# EAGLE design receiver_mp3 (EAGLE 9.4.2)
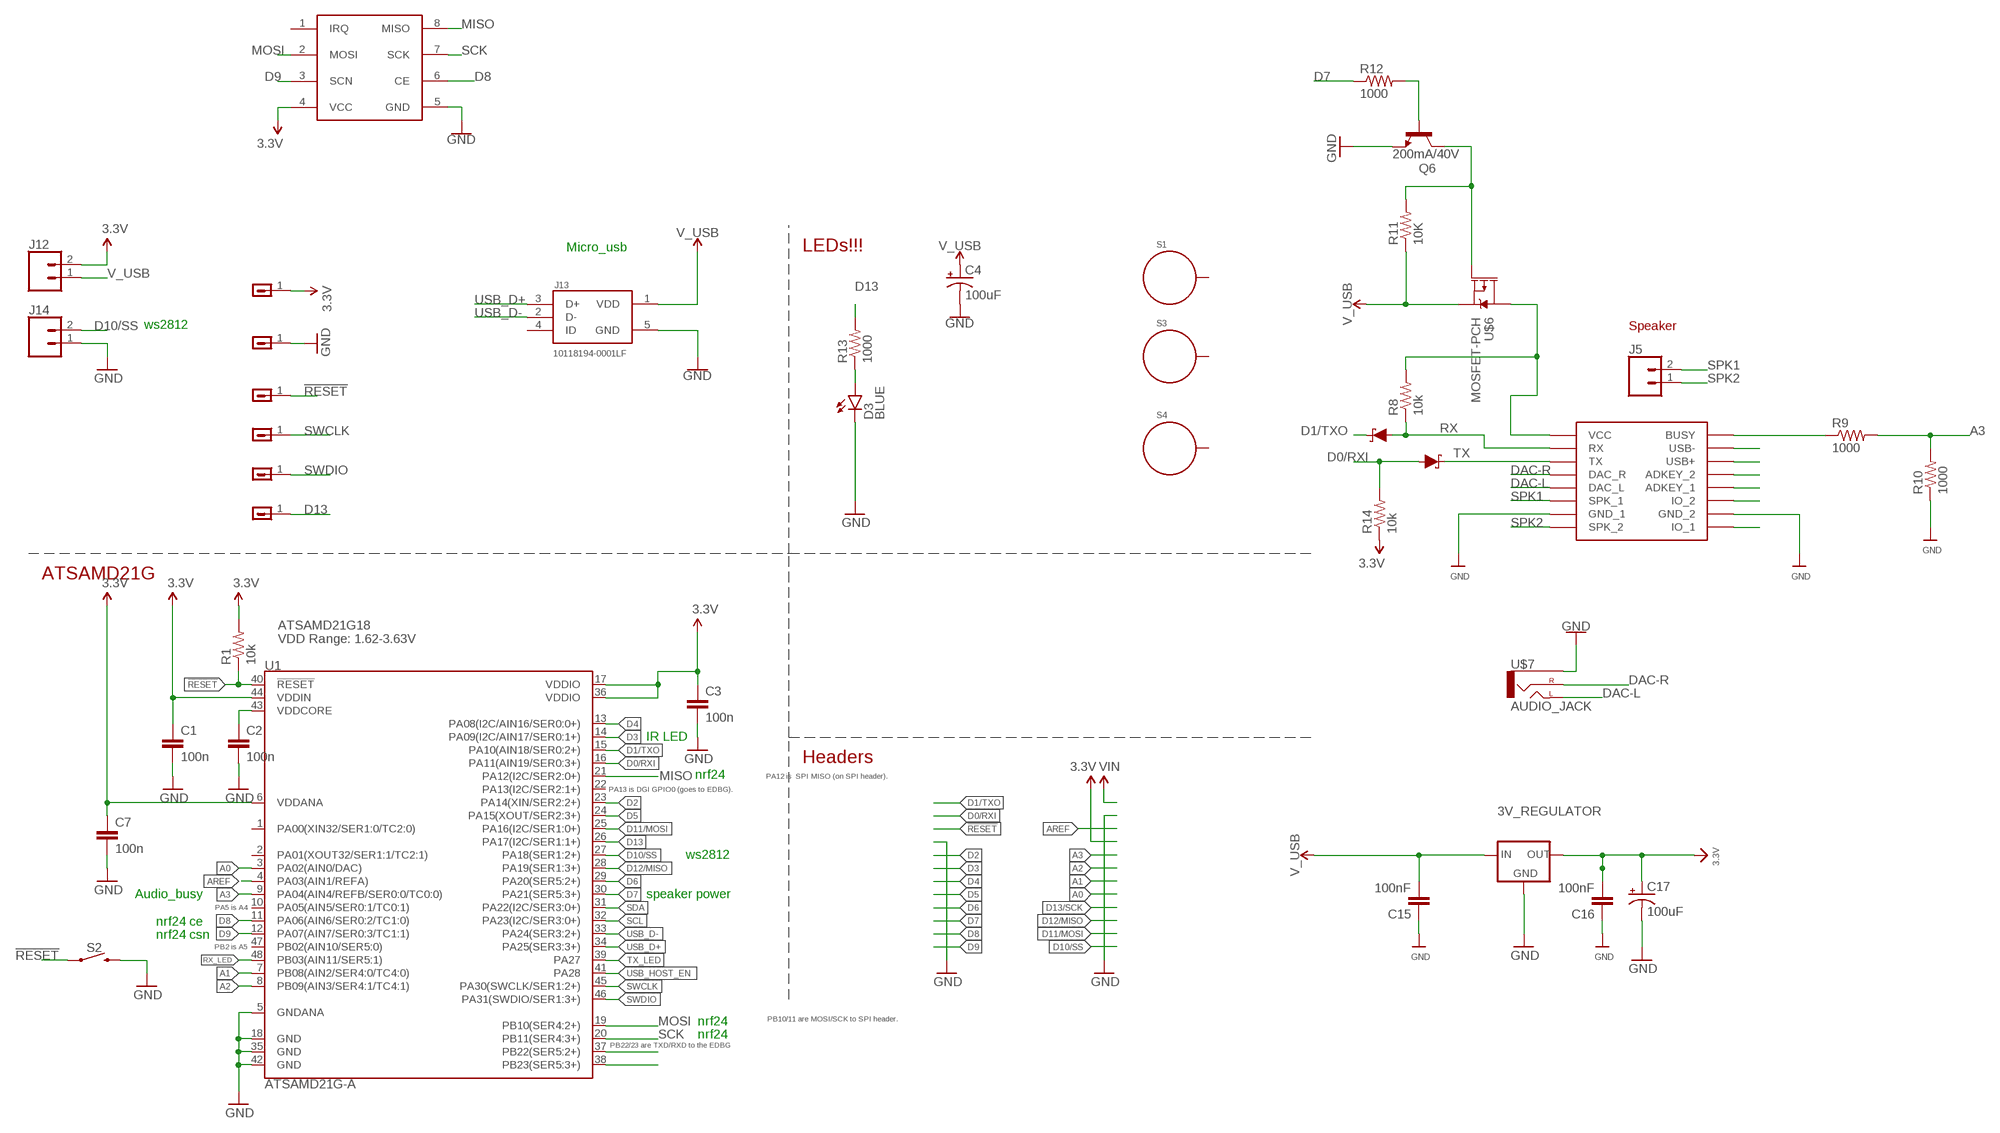
[diagram p0: schematic, sheet 1]

## Parts
3V_REGULATOR  LDL1117_5V_REG  [SOT223]
C1  100n  CAP0805  [0805]
C2  100n  CAP0805  [0805]
C3  100n  CAP0805  [0805]
C4  100uF  100UF-POLAR-RADIAL-2.5MM-25V-20%  [CPOL-RADIAL-2.5MM-6.5MM]
C7  100n  CAP0805  [0805]
C15  100nF  10UF-0805-10V-10%  [0805]
C16  100nF  10UF-0805-10V-10%  [0805]
C17  100uF  100UF-POLAR-RADIAL-2.5MM-25V-20%  [CPOL-RADIAL-2.5MM-6.5MM]
D1  3A/40V/500mV  DIODE-SCHOTTKY-B340A  [SMA-DIODE]
D3  BLUE  LED-BLUE1206  [LED-1206]
D5  3A/40V/500mV  DIODE-SCHOTTKY-B340A  [SMA-DIODE]
J5  CONN_025MM  [SCREWTERMINAL-5MM-2]
J12  CONN_025MM  [SCREWTERMINAL-5MM-2]
J13  10118194-0001LF  [FRAMATOME_10118194-0001LF]
J14  CONN_025MM  [SCREWTERMINAL-5MM-2]
Q6  200mA/40V  TRANS_NPN-2N3904-EZ  [TO-92-EZ]
R1  10k  RESISTOR0805-RES  [0805]
R8  10k  RESISTOR0805-RES  [0805]
R9  1000  RESISTOR0805-RES  [0805]
R10  1000  RESISTOR0805-RES  [0805]
R11  10K  RESISTOR0805-RES  [0805]
R12  1000  RESISTOR0805-RES  [0805]
R13  1000  RESISTOR0805-RES  [0805]
R14  10k  RESISTOR0805-RES  [0805]
S1  STANDOFF_ELECTRICAL144  [STANDOFF_ELECTRICAL_144MILL_NORMAL_SCREW]
S2  MOMENTARY-SWITCH-SPST-PTH-6.0MM-KIT  [TACTILE_SWITCH_PTH_6.0MM_KIT]
S3  STANDOFF_ELECTRICAL144  [STANDOFF_ELECTRICAL_144MILL_NORMAL_SCREW]
S4  STANDOFF_ELECTRICAL144  [STANDOFF_ELECTRICAL_144MILL_NORMAL_SCREW]
U1  ATSAMD21G-A  [TQFP-48]
U$1  DFPLAYER  [DFPLAYER]
U$3  NRF24L01  [NRF24L01]
U$6  MOSFET-PCH  [DPAK]
U$7  AUDIO_JACK  [1/8"AUDIO_JACK]
U$8  CONN_011.27MM  [1X01-1.27MM]
U$13  CONN_011.27MM  [1X01-1.27MM]
U$18  CONN_011.27MM  [1X01-1.27MM]
U$19  CONN_011.27MM  [1X01-1.27MM]
U$20  CONN_011.27MM  [1X01-1.27MM]
U$22  CONN_011.27MM  [1X01-1.27MM]

## Nets
3.3V: 3V_REGULATOR.2(OUT) 3V_REGULATOR.4(OUT) C1.1 C3.1 C7.1 C16.2 C17.1(+) J12.2 R1.2 R14.1 U1.6(VDDANA) U1.17(VDDIO) U1.36(VDDIO) U1.44(VDDIN) U$3.4(VCC) U$18.1
!RESET: R1.1 S2.1 U1.40(!RESET!) U$20.1
A0: U1.3(PA02(AIN0/DAC))
A1: U1.7(PB08(AIN2/SER4:0/TC4:0))
A2: U1.8(PB09(AIN3/SER4:1/TC4:1))
A3: R9.2 R10.2 U1.9(PA04(AIN4/REFB/SER0:0/TC0:0))
AREF: U1.4(PA03(AIN1/REFA))
D0/RXI: D5.A R14.2 U1.16(PA11(AIN19/SER0:3+))
D1/TXO: D1.C U1.15(PA10(AIN18/SER0:2+))
D2: U1.23(PA14(XIN/SER2:2+))
D3: U1.14(PA09(I2C/AIN17/SER0:1+))
D4: U1.13(PA08(I2C/AIN16/SER0:0+))
D5: U1.24(PA15(XOUT/SER2:3+))
D6: U1.29(PA20(SER5:2+))
D7: R12.1 U1.30(PA21(SER5:3+))
D8: U1.11(PA06(AIN6/SER0:2/TC1:0)) U$3.6(CE)
D9: U1.12(PA07(AIN7/SER0:3/TC1:1)) U$3.3(SCN)
D10/SS: J14.2 U1.27(PA18(SER1:2+))
D11/MOSI: U1.25(PA16(I2C/SER1:0+))
D12/MISO: U1.28(PA19(SER1:3+))
D13: R13.2 U1.26(PA17(I2C/SER1:1+)) U$8.1
DAC-L: U$1.DAC_L U$7.LEFT_TIP_1(LEFT)
DAC-R: U$1.DAC_R U$7.RIGHT
GND: 3V_REGULATOR.1(GND) C1.2 C2.2 C3.2 C4.2(-) C7.2 C15.1 C16.1 C17.2(-) D3.C J13.5(GND) J14.1 Q6.1(E) R10.1 S2.3 U1.5(GNDANA) U1.18(GND) U1.35(GND) U1.42(GND) U$1.GND_1 U$1.GND_2 U$3.5(GND) U$7.GND(SLEEVE) U$13.1
INT1: U1.38(PB23(SER5:3+))
MISO: U1.21(PA12(I2C/SER2:0+)) U$3.8(MISO)
MOSI: U1.19(PB10(SER4:2+)) U$3.2(MOSI)
N$2: U1.37(PB22(SER5:2+))
N$4: R8.2 U$1.VCC U$6.4(D)
N$6: D3.A R13.1
N$9: Q6.3(C) R11.2 U$6.1(G)
N$10: Q6.2(B) R12.2
N$18: R9.1 U$1.BUSY
N$19: U$1.USB-
N$20: U$1.USB+
N$22: U$1.ADKEY2(ADKEY_2)
N$23: U$1.ADKEY1(ADKEY_1)
N$24: U$1.IO2(IO_2)
N$26: U$1.IO1(IO_1)
RX: D1.A R8.1 U$1.RX
RX_LED: U1.48(PB03(AIN11/SER5:1))
SCK: U1.20(PB11(SER4:3+)) U$3.7(SCK)
SCL: U1.32(PA23(I2C/SER3:0+))
SDA: U1.31(PA22(I2C/SER3:0+))
SPK1: J5.2 U$1.SPK1(SPK_1)
SPK2: J5.1 U$1.SPK2(SPK_2)
SWCLK: U1.45(PA30(SWCLK/SER1:2+)) U$22.1
SWDIO: U1.46(PA31(SWDIO/SER1:3+)) U$19.1
TX: D5.C U$1.TX
TX_LED: U1.39(PA27)
USB_D+: J13.3(D+) U1.34(PA25(SER3:3+))
USB_D-: J13.2(D-) U1.33(PA24(SER3:2+))
USB_HOST_EN: U1.41(PA28)
V_USB: 3V_REGULATOR.3(IN) C4.1(+) C15.2 J12.1 J13.1(VDD) R11.1 U$6.3(S)
VDDCORE: C2.1 U1.43(VDDCORE)
Unconnected: J13.4(ID) S1.P1 S3.P1 S4.P1 U1.1(PA00(XIN32/SER1:0/TC2:0)) U1.2(PA01(XOUT32/SER1:1/TC2:1)) U1.10(PA05(AIN5/SER0:1/TC0:1)) U1.22(PA13(I2C/SER2:1+)) U1.47(PB02(AIN10/SER5:0)) U$3.1(IRQ)

## Notes on the sheet
- LEDs!!!
- Micro_usb
- ws2812 | Speaker
- ATSAMD21G
- ATSAMD21G18
  VDD Range: 1.62-3.63V
- IR LED
- Headers
- PA12 is  SPI MISO (on SPI header).
- nrf24
- PA13 is DGI GPIO0 (goes to EDBG).
- ws2812
- Audio_busy | speaker power
- PA5 is A4
- nrf24 ce
- nrf24 csn
- PB2 is A5
- PB10/11 are MOSI/SCK to SPI header.
- nrf24
- nrf24
- PB22/23 are TXD/RXD to the EDBG

## Library data of the parts
3V_REGULATOR = th_libraries_2:LDL1117_5V_REG: STMicroelectronics LDL1117S50R https://www.mouser.com/datasheet/2/389/ldl1117-1156241.pdf Mouser#: 511-LDL1117S50R bought 100 for $18 on ~2/3/18 5V, 1.2amp
C1-C3 C7 = SparkFun:CAP: Capacitor Standard 0603 ceramic capacitor, and 0.1" leaded capacitor.
C4 C17 = SparkFun-Capacitors:100UF-POLAR: 100µF polarized capacitors A capacitor is a passive two-terminal electrical component used to store electrical energy temporarily in an electric field.; PROD_ID: CAP-08439
C15 C16 = SparkFun-Capacitors:10UF: 10.0µF ceramic capacitors A capacitor is a passive two-terminal electrical component used to store electrical energy temporarily in an electric field.; PROD_ID: CAP-11330; VALUE: 10uF
D1 D5 = SparkFun-DiscreteSemi:DIODE-SCHOTTKY: Schottky diode A Schottky diode is a semiconductor diode which has a low forward voltage drop and a very fast switching action.; PROD_ID: DIO-09886
D3 = SparkFun-LED:LED-BLUE: Blue LEDs for production use Various blue LEDs stocked by SparkFun production 0603 - DIO-08575 Rebel - DIO-09553 1206 - DIO-09911; PROD_ID: DIO-09911
J5 J12 J14 = SparkFun-Connectors:CONN_02: Multi connection point. Often used as Generic Header-pin footprint for 0.1 inch spaced/style header connections On any of the 0.1 inch spaced packages, you can populate with these: Break Away Headers - Straight <https://www.sparkfun.com/products/116> (PRT-00116) Break Away Male Headers - Right Angle <https://www.sparkfun.com/products/553> (PRT-00553) Female Headers <https://www.sparkfun.com/products/115> (PRT-00115) Break Away Headers - Machine Pin <https://www.sparkfun.com/products/117> (PRT-00117) Break Away Female Headers - Swiss Machine Pin <https://www.sparkfun.com/products/743> (PRT-00743) For SCREWTERMINALS and SPRING TERMINALS visit here: Screw Terimnals on SparkFun.com <https://www.sparkfun.com/search/results?term=Screw+Terminals> (5mm/3.5mm/2.54mm spacing) This device is also useful as a general connection point to wire up your design to another part of your project. Our various solder wires solder well into these plated through hole pads. Hook-Up Wire - Assortment (Stranded, 22 AWG) <https://www.sparkfun.com/products/11375> (PRT-11375) Hook-Up Wire - Assortment (Solid Core, 22 AWG) <https://www.sparkfun.com/products/11367> (PRT-11367) View the entire wire category on our website here <https://www.sparkfun.com/categories/141> Special notes: Molex polarized connector foot print use with: PRT-08233 with associated crimp pins and housings. 2.54_SCREWTERM for use with PRT-10571. 3.5mm Screw Terminal footprints for PRT-08084 5mm Screw Terminal footprints for use with PRT-08432; SF_SKU: PRT-08432
J13 = 10118194-0001LF:10118194-0001LF: Conn Micro USB Type B RCP 5 POS 0.65mm Solder RA SMD 5 Terminal 1 Port T/R; AVAILABILITY: Unavailable; DESCRIPTION: Micro Usb, 2.0 Type b, Rcpt, Smt; MF: Amphenol ICC; MP: 10118194-0001LF; PACKAGE: None; PRICE: None
Q6 = SparkFun-DiscreteSemi:TRANS_NPN: NPN transistor Current controlled devices typically used to amplify current or used as a switch. BC547 - COM-08928 <http://www.sparkfun.com/products/8928> (TO-92 45V 100mA) (1.Collector 2.Base 3.Emitter) 2N3904 - COM-00521 <http://www.sparkfun.com/products/521> (TO-92 40V 200mA) (1.Emitter 2.Base 3.Collector) P2N2222A - COM-12852 <http://www.sparkfun.com/products/12852> (TO-92 40V 600mA) (1.Collector 2.Base 3.Emitter); PROD_ID: TRANS-08447
R1 R8 R14 = SparkFun:RESISTOR: Resistor Basic schematic elements and footprints for 0603, 1206, and PTH resistors.
R9-R13 = SparkFun-Passives:RESISTOR: Resistor Basic schematic elements and footprints for 0603, 1206, and PTH resistors.
S1 S3 S4 = th_libraries:STANDOFF_ELECTRICAL: A standoff intended to be an electrically connected point. Pad size and stop size allow for a #8 Phillips pan screw head to make a solid connection to the board. Added 144mill drill hole that fits my normal wood screw
S2 = SparkFun-Switches:MOMENTARY-SWITCH-SPST: Momentary Switch (Pushbutton) - SPST Normally-open (NO) SPST momentary switches (buttons, pushbuttons). Variants PTH-12MM - 12mm square, through-hole Momentary Pushbutton Switch - 12mm Square <https://www.sparkfun.com/products/9190> (COM-09190) PTH-6.0MM, PTH-6.0MM-KIT - 6.0mm square, through-hole Mini Pushbutton Switch <https://www.sparkfun.com/products/97> (COM-00097) KIT package intended for soldering kit's - only one side of pads' copper is exposed. PTH-RIGHT-ANGLE-KIT - Right-angle, through-hole Right Angle Tactile Button <https://www.sparkfun.com/products/10791> - Used on SparkFun BigTime Watch Kit <https://www.sparkfun.com/products/11734> SMD-12MM - 12mm square, surface-mount Tactile Button - SMD (12mm) <https://www.sparkfun.com/products/12993> (COM-12993) Used on SparkFun PicoBoard <https://www.sparkfun.com/products/11888> SMD-4.5MM - 4.5mm Square Trackball Switch Used on SparkFun Blackberry Trackballer Breakout <https://www.sparkfun.com/products/13169> SMD-4.6MMX2.8MM - 4.60mm x 2.80mm, surface mount Used on SparkFun SAMD21 Mini Breakout <https://www.sparkfun.com/products/13664> SMD-5.2MM, SMD-5.2-REDUNDANT - 5.2mm square, surface-mount Mini Pushbutton Switch - SMD <https://www.sparkfun.com/products/8720> (COM-08720) Used on Arduino Pro Mini <https://www.sparkfun.com/products/11114> REDUNDANT package connects both switch circuits together SMD-6.0X3.5MM - 6.0 x 3.5mm, surface mount Momentary Reset Switch SMD <https://www.sparkfun.com/products/8229> (COM-08229) SMD-6.2MM-TALL - 6.2mm square, surface mount Tactile Button - SMD (6mm) <https://www.sparkfun.com/products/12992> Used on SparkFun Digital Sandbox <https://www.sparkfun.com/products/12651> SMD-RIGHT-ANGLE - Right-angle, surface mount Used on SparkFun Block for Intel® Edison - Arduino <https://www.sparkfun.com/products/13036>; PROD_ID: SWCH-08441; SF_SKU: COM-00097
U1 = samd21-temp:ATSAMD21G: Atmel SAMD21G SMART ARM-Based Microcontroller The Atmel ® | SMART ™ SAM D21 is a series of low-power microcontrollers using the 32-bit ARM ® Cortex ® -M0+ processor, and ranging from 32- to 64-pins with up to 256KB Flash and 32KB of SRAM. The SAM D21 devices operate at a maximum frequency of 48MHz and reach 2.46 CoreMark/MHz. They are designed for simple and intuitive migration with identical peripheral modules, hex compatible code, identical linear address map and pin compatible migration paths between all devices in the product series. All devices include intelligent and flexible peripherals, Atmel Event System for inter-peripheral signaling, and support for capacitive touch button, slider and wheel user interfaces.; PROD_ID: IC-13064
U$1 = DFPlayer_v1:DFPLAYER
U$3 = th_libraries:NRF24L01: Added to Pickathon 2019 speaker project break
U$6 = th_libraries:MOSFET-PCH
U$7 = th_libraries:AUDIO_JACK
U$8 U$13 U$18-U$20 U$22 = th_libraries:CONN_01

## Net classes
1 power: width 0.254 mm

## Board
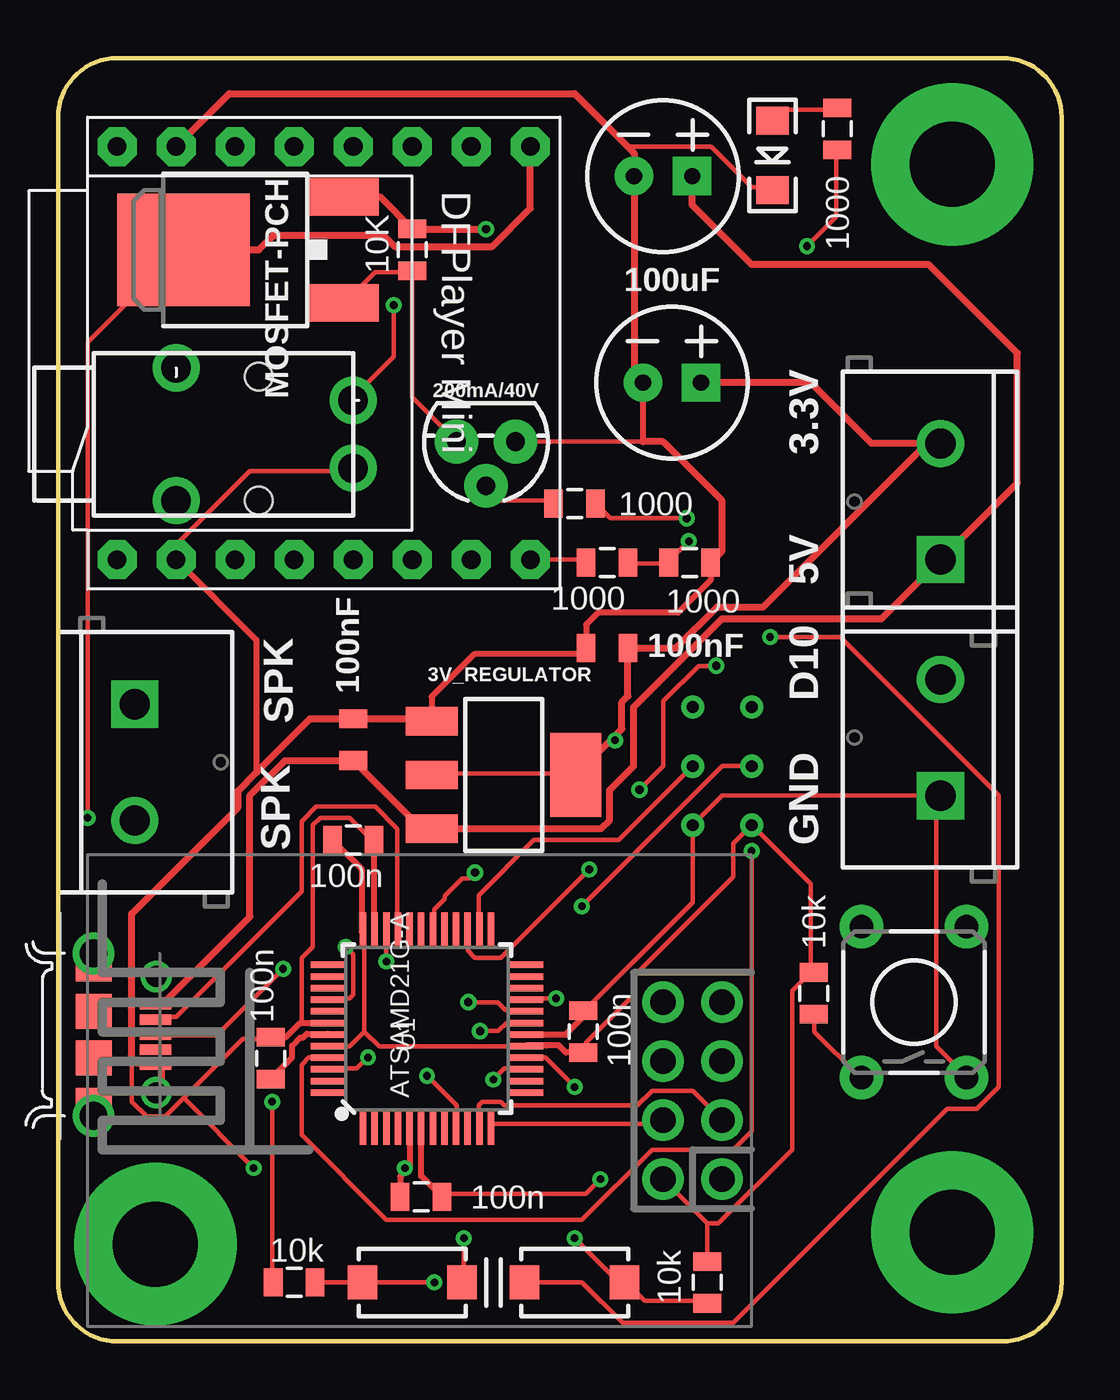
[diagram p1: board, top side]
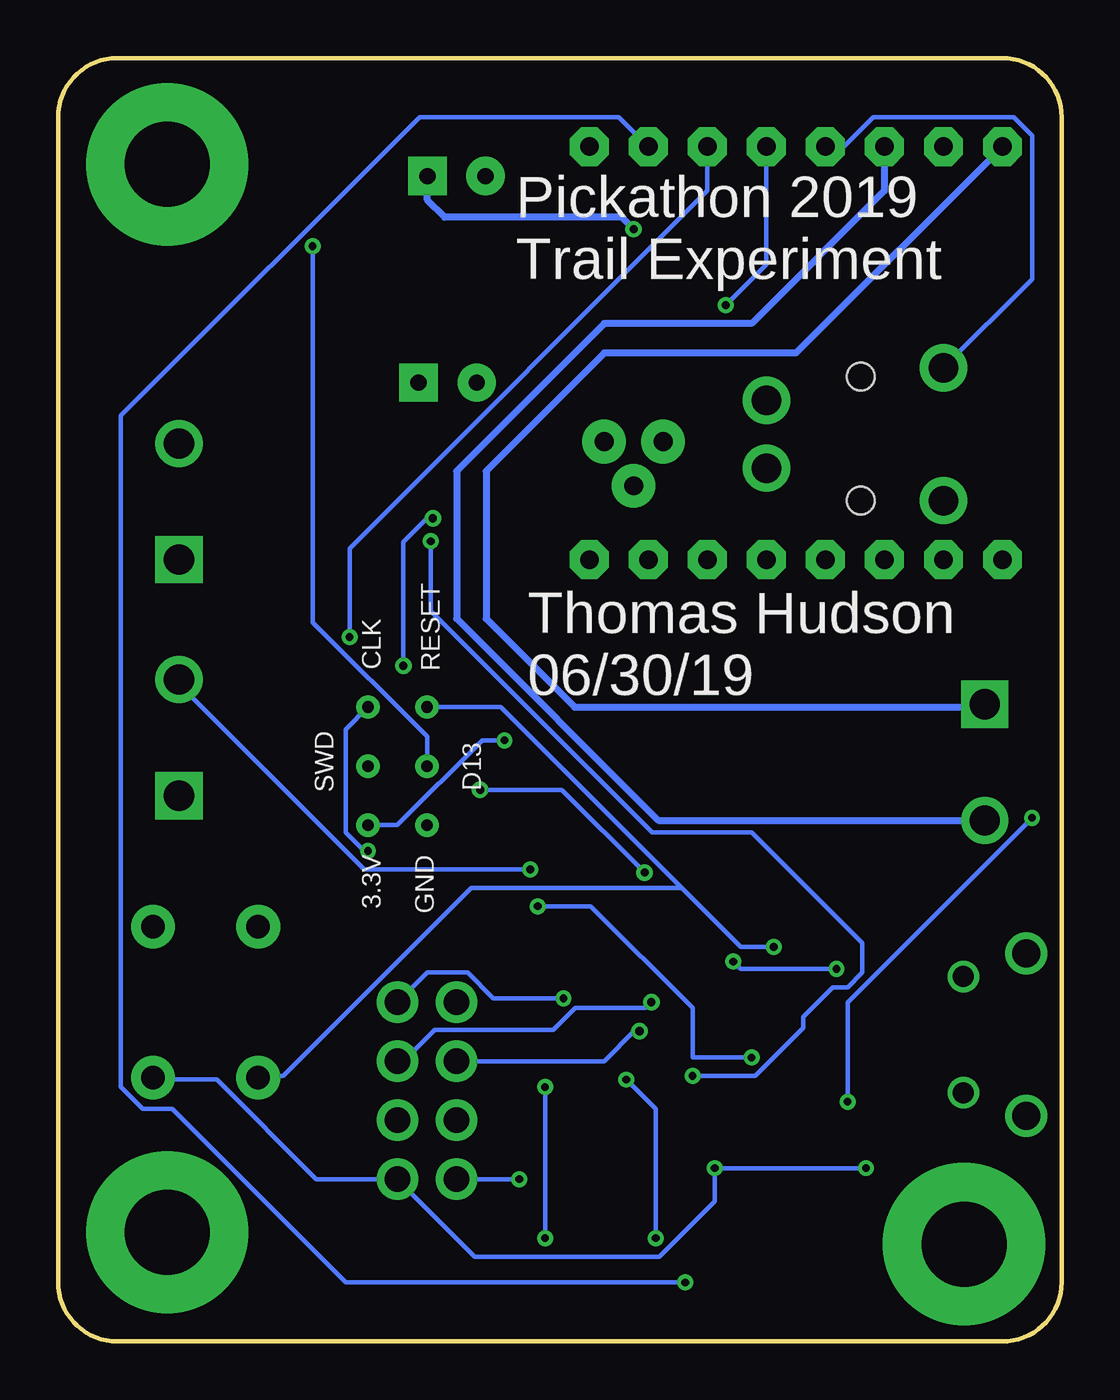
[diagram p2: board, bottom side, seen from below]

Size 43.18 x 55.24 mm. Coordinates in mm from the lower left corner, seen from the top.
Outline: 40.64,0 2.54,0 arc-90 0,2.54 0,52.7 arc-90 2.54,55.24 40.64,55.24 arc-90 43.18,52.7 43.18,2.54 arc-90 40.64,0
Copper layers (1*16): Top 0.0356mm / dielectric 1.5011mm / Bottom 0.0356mm
Design rules "LaenPCBOrder *": minimum track width 8mil, minimum drill 13mil, track to track 8mil, track to pad 8mil, pad to pad 6mil, via to via 8mil, smd to smd 6mil, copper to edge 15mil, drill to drill 6mil, minimum pad ring 7mil, minimum via ring 7mil, stop-mask expansion 3mil, vias tented up to drill 25mil, thermal gap 10mil

### Footprints (pad centres in the part's own frame; a part is rotated, then mirrored left to right if it is on the bottom)
SOT223 = smd 1.219 x 2.235: 1 -2.311,-3.099; 2 0,-3.099; 3 2.311,-3.099 | smd 3.6 x 2.2: 4 0,3.099
0805 = smd 0.8 x 1.2: 1 -0.9,0; 2 0.9,0
CPOL-RADIAL-2.5MM-6.5MM = drill 0.7 pad 1.651 square: 1 1.25,0 | drill 0.7 pad 1.651: 2 -1.25,0
SMA-DIODE = smd 1.27 x 1.47: A -2.15,0; C 2.15,0
LED-1206 = smd 1.2 x 1.4: A -1.5,0; C 1.5,0
SCREWTERMINAL-5MM-2 = drill 1.3 pad 2.032 square: 1 0,0 | drill 1.3 pad 2.032: 2 5,0
FRAMATOME_10118194-0001LF = smd 0.45 x 1.35: 1 -1.3,2.675; 2 -0.65,2.675; 3 0,2.675; 4 0.65,2.675; 5 1.3,2.675 | drill 0.9: P$6 -2.5,2.7; P$7 2.5,2.7 | drill 1.2: P$8 -3.5,0; P$9 3.5,0 | smd 1.5 x 1.55: P$10 -1,0; P$11 1,0; P$12 -3.05,0; P$13 3.05,0
TO-92-EZ = drill 0.813 pad 1.88: 1 -1.27,0; 2 0,1.905; 3 1.27,0
STANDOFF_ELECTRICAL_144MILL_NORMAL_SCREW = drill 3.658 pad 6.985: P1 0,0
TACTILE_SWITCH_PTH_6.0MM_KIT = drill 1.016 pad 1.88: 1 -3.251,2.261; 2 3.251,2.261; 3 -3.251,-2.261; 4 3.251,-2.261
TQFP-48 = smd 1.5 x 0.28: 1 -4.25,2.75; 2 -4.25,2.25; 3 -4.25,1.75; 4 -4.25,1.25; 5 -4.25,0.75; 6 -4.25,0.25; 7 -4.25,-0.25; 8 -4.25,-0.75; 9 -4.25,-1.25; 10 -4.25,-1.75; 11 -4.25,-2.25; 12 -4.25,-2.75; 25 4.25,-2.75; 26 4.25,-2.25; 27 4.25,-1.75; 28 4.25,-1.25; 29 4.25,-0.75; 30 4.25,-0.25; 31 4.25,0.25; 32 4.25,0.75; 33 4.25,1.25; 34 4.25,1.75; 35 4.25,2.25; 36 4.25,2.75 | smd 0.28 x 1.5: 13 -2.75,-4.25; 14 -2.25,-4.25; 15 -1.75,-4.25; 16 -1.25,-4.25; 17 -0.75,-4.25; 18 -0.25,-4.25; 19 0.25,-4.25; 20 0.75,-4.25; 21 1.25,-4.25; 22 1.75,-4.25; 23 2.25,-4.25; 24 2.75,-4.25; 37 2.75,4.25; 38 2.25,4.25; 39 1.75,4.25; 40 1.25,4.25; 41 0.75,4.25; 42 0.25,4.25; 43 -0.25,4.25; 44 -0.75,4.25; 45 -1.25,4.25; 46 -1.75,4.25; 47 -2.25,4.25; 48 -2.75,4.25
DFPLAYER = drill 0.8 pad 1.676 octagon: ADKEY1 8.89,-1.27; ADKEY2 8.89,1.27; BUSY 8.89,8.89; DAC_L -8.89,-1.27; DAC_R -8.89,1.27; GND_1 -8.89,-6.35; GND_2 8.89,-6.35; IO1 8.89,-8.89; IO2 8.89,-3.81; RX -8.89,6.35; SPK1 -8.89,-3.81; SPK2 -8.89,-8.89; TX -8.89,3.81; USB+ 8.89,3.81; USB- 8.89,6.35; VCC -8.89,8.89
NRF24L01 = drill 1.092 pad 1.778: 1 -1.27,7.62; 2 -1.27,5.08; 3 -1.27,2.54; 4 -1.27,0; 5 1.27,0; 6 1.27,2.54; 7 1.27,5.08; 8 1.27,7.62
DPAK = smd 1.6 x 3: 1 -2.28,-5.31; 3 2.28,-5.31 | smd 4.826 x 5.715: 4 0,1.588
1/8"AUDIO_JACK = drill 1.27 pad 2.032: GND 7.62,-4.318; LEFT_TIP_1 0,0; NC 0,-5.715; RIGHT 7.62,-1.397 | hole 1.2: 3.556,-0.381; 3.556,-5.715
1X01-1.27MM = drill 0.508 pad 1: 1 0,0

### Placement (x,y rotation side)
3V_REGULATOR  19.18,24.38 270 top
C1  15.62,6.22 180 top
C2  9.14,12.19 90 top
C3  12.7,21.59 0 top
C4  26.04,50.16 0 top
C7  22.61,13.34 90 top
C15  12.7,25.91 270 top
C16  23.62,29.84 0 top
C17  26.42,41.27 0 top
D1  15.24,2.54 0 top
D3  30.73,51.05 270 top
D5  22.23,2.54 180 top
J5  3.3,27.43 270 top
J12  37.97,33.66 90 top
J13  1.52,13.21 270 top
J14  37.97,23.5 90 top
Q6  18.41,38.73 180 top
R1  32.51,14.99 90 top
R8  10.16,2.54 180 top
R9  23.62,33.53 0 top
R10  27.18,33.53 180 top
R11  15.24,46.99 270 top
R12  22.23,36.07 180 top
R13  33.53,52.2 270 top
R14  27.94,2.54 270 top
S1  38.48,4.7 0 top
S2  36.83,14.61 90 top
S3  38.48,50.67 0 top
S4  4.19,4.19 0 top
U1  15.88,13.46 90 top
U$1  11.43,42.55 270 top
U$3  27.3,6.98 0 top
U$6  6.98,46.99 90 top
U$7  5.08,41.91 0 top
U$8  27.3,24.77 270 bottom
U$13  27.3,22.23 270 bottom
U$18  29.84,22.23 270 bottom
U$19  29.84,24.77 270 bottom
U$20  27.3,27.3 270 bottom
U$22  29.84,27.3 270 bottom

### Tracks (layer width: path | path; a pad name or v marks a point on that pad's centre or on a via)
3.3V  (via drill 0.33)
  Top 0.203: 27.94,5.08 R14.1 | U$3.4 27.94,5.08 | v23.34,6.98 22.7,6.35 16.67,6.35 C1.1 | 13.18,13.34 12.54,12.7 11.75,12.7 U1.44 | 13.18,13.34 13.18,17.46 13.02,17.62 U1.36 | 13.18,13.34 13.81,12.7 20,12.7 U1.17 | 3V_REGULATOR.2 16.19,24.45 22.23,24.45 3V_REGULATOR.4 | v23.97,25.88 23.87,25.98 | C7.1 22.7,12.54 22.7,12.86 24.77,14.92 24.77,15.72 29.05,20 29.05,21.43 U$18.1 32.38,19.68 32.38,16.03 R1.2 32.38,15.88 31.59,15.08 31.59,8.25 28.42,5.08 27.94,5.08
  Top 0.254: C7.1 21.86,12.43 21.54,12.75 21.02,12.75 21.01,12.74 20.16,12.74 U1.17 | C1.1 15.62,7.12 U1.6 | U1.36 13.08,17.76 13.08,20.31 C3.1
  Top 0.305: 3V_REGULATOR.4 23.87,25.98 24.26,26.36 24.26,27.52 24.52,27.78 C16.2 26.59,29.84 28.37,31.62 30.35,31.62 37.38,38.66 J12.2 35.01,38.66 32.38,41.27 C17.1
  Bottom 0.203: U$3.4 v23.34,6.98 | v23.97,25.88 24.92,25.88 28.57,22.23 U$18.1
!RESET  (via drill 0.33)
  Top 0.203: R1.1 32.54,13.97 32.54,13.34 34.45,11.43 S2.1 | v12.38,16.99 12.7,16.67 12.7,14.92 12.54,14.76 11.75,14.76 U1.40
  Bottom 0.203: v12.38,16.99 13.81,16.99 16.35,19.53 | 16.35,19.53 24.13,27.3 U$20.1 | 16.35,19.53 25.4,19.53 33.5,11.43 34.45,11.43 S2.1
A3  (via drill 0.33)
  Top 0.203: R9.2 24.61,33.5 26.19,33.5 R10.2 26.35,33.66 v27.15,34.45 | v15.88,11.43 17.14,10.16 17.14,9.37 U1.9
  Bottom 0.203: v15.88,11.43 13.18,11.43 11.11,13.49 11.11,13.97 9.84,15.24 9.21,15.24 8.57,15.88 8.57,17.14 13.34,21.91 17.62,21.91 27.15,31.43 v27.15,34.45
D0/RXI  (via drill 0.33)
  Top 0.203: R14.2 27.94,1.75 25.24,1.75 24.45,2.54 D5.A 24.13,2.54 v22.23,4.45 | v22.23,10.95 20.95,12.22 20.16,12.22 U1.16
  Bottom 0.203: v22.23,4.45 v22.23,10.95
D1/TXO  (via drill 0.33)
  Top 0.203: v17.46,4.45 17.46,2.54 D1.C | v18.73,11.27 19.21,11.75 20,11.75 U1.15
  Bottom 0.203: v17.46,4.45 17.46,10 v18.73,11.27
D7  (via drill 0.35)
  Top 0.203: U1.30 16.18,17.77 16.18,18.59 16.64,19.04 16.64,19.18 17.4,19.94 17.69,19.94 v17.94,20.18 | v25.02,23.75 26.04,24.77 26.04,27.56 27.56,29.08 v28.32,29.08 | v27.05,35.43 23.76,35.43 R12.1
  Bottom 0.203: v17.94,20.18 21.5,23.75 v25.02,23.75 | v27.05,35.43 27.3,35.43 28.32,34.42 v28.32,29.08
D8
  Top 0.203: U$3.6 27.3,10.79 25.56,10.79 24.92,10.16 19.21,10.16 19.05,10.32 18.26,10.32 18.1,10.16 18.1,9.37 U1.11
D9
  Top 0.203: U$3.3 25.88,9.37 18.73,9.37 U1.12
D10/SS  (via drill 0.33)
  Top 0.203: v22.86,20.32 19.05,16.51 17.94,16.51 17.62,16.83 17.62,17.62 U1.27
  Bottom 0.203: v22.86,20.32 30,20.32 38.1,28.42 J14.2
D13  (via drill 0.33)
  Top 0.203: v32.23,47.15 33.5,48.42 33.5,51.28 R13.2 | U$8.1 24.13,21.59 20.48,21.59 18.1,19.21 18.1,17.78 U1.26
  Bottom 0.203: v32.23,47.15 32.23,30.96 27.3,26.04 U$8.1
DAC-L
  Bottom 0.203: U$1.DAC_L 9.37,51.44 8.1,52.7 2.06,52.7 1.27,51.91 1.27,45.72 U$7.LEFT_TIP_1
DAC-R  (via drill 0.33)
  Top 0.203: v14.45,44.61 14.45,42.39 12.7,40.64 U$7.RIGHT
  Bottom 0.203: U$1.DAC_R 12.7,46.35 v14.45,44.61
GND  (via drill 0.33)
  Top 0.203: C7.2 22.7,14.29 27.3,18.89 U$13.1 28.57,23.5 37.78,23.5 | 37.78,23.5 J14.1 37.94,23.5 | v14.92,7.46 15,7.38 | 37.78,23.5 37.78,12.7 39.05,11.43 S2.3 | D3.C 30.64,49.69 29.84,49.69 28.1,51.44 24.61,51.44 24.56,51.39 | 5.4,10.48 4.6,9.68 3.81,9.68 3.18,10.32 3.18,12.07 3.17,12.19 | 5.4,10.48 7.94,13.02 9.05,13.02 C2.2 | C3.2 13.49,21.59 12.54,22.54 11.27,22.54 10.95,22.23 10.95,16.99 10.48,16.51 10.48,13.81 10.41,13.71 | 25.17,38.73 Q6.1 | U$7.GND 12.7,37.46 8.25,37.46 5.24,34.45 5.24,33.66 U$1.GND_2 | 5.4,10.48 v8.41,7.46
  Top 0.254: C2.2 9.79,13.09 10.41,13.71 U1.42 | U1.18 21.85,13.21 22.61,13.97 C7.2 | U1.5 15.12,7.5 15,7.38 14.72,7.1 C1.2 | U1.35 13.6,17.74 C3.2 | U$1.GND_2 8.53,30.2 8.53,24.49 | C17.2 25.17,38.73 | R10.1 28.08,32.77 26.68,31.37 23.24,31.37 22.72,30.85 C16.1 22.47,29.59 17.91,29.59 16.08,27.76 3V_REGULATOR.1
  Top 0.305: J13.5 4.13,11.98 3.38,11.98 3.17,12.19 3.17,18.41 7.75,22.99 7.75,23.7 8.53,24.49 10.85,26.81 C15.1 15.97,26.81 3V_REGULATOR.1 | C17.2 24.79,41.66 C4.2 24.79,51.16 24.56,51.39 22.23,53.72 7.37,53.72 U$1.GND_1 | R10.1 28.57,34.02 28.57,36.2 26.04,38.73 25.17,38.73
  Bottom 0.203: S2.3 39.05,11.27 36.35,11.27 32.07,6.98 U$3.5 25.24,3.65 17.3,3.65 14.92,6.03 v14.92,7.46 v8.41,7.46
MISO  (via drill 0.33)
  Top 0.203: v21.43,14.76 20.16,14.76 U1.21
  Bottom 0.203: v21.43,14.76 24.45,14.76 25.56,15.88 27.3,15.88 U$3.8
MOSI  (via drill 0.35)
  Top 0.203: v18.16,13.36 18.95,13.36 19.3,13.71 U1.19
  Bottom 0.203: U$3.2 19.69,12.07 18.39,13.36 v18.16,13.36
N$1
  Top 0.305: 4.45,11.81 4.45,11.05
N$4  (via drill 0.33)
  Top 0.203: v9.21,10.32 9.21,2.54 R8.2 | v1.27,22.54 1.27,43.02 5.24,46.99 U$6.4
  Top 0.305: U$6.4 8.64,46.99 9.27,47.62 14,47.62 14.49,47.13 18.67,47.13 20.32,48.78 U$1.VCC
  Bottom 0.203: v9.21,10.32 9.21,14.61 v1.27,22.54
N$6
  Top 0.203: R13.1 33.5,53.02 31.12,53.02 30.8,52.7 D3.A
N$9
  Top 0.203: 15.24,46.04 13.65,46.04 12.38,44.77 U$6.1 | 15.24,46.04 15.24,40.64 Q6.3 | 15.24,46.04 R11.2
N$10
  Top 0.203: Q6.2 19.05,36.2 21.27,36.2 R12.2
N$18
  Top 0.203: U$1.BUSY 22.7,33.66 R9.1
RX  (via drill 0.33)
  Top 0.203: R8.1 D1.A v16.19,2.54
  Bottom 0.203: v16.19,2.54 30.8,2.54 38.26,10 39.53,10 40.48,10.95 40.48,39.85 27.62,52.7 19.05,52.7 U$1.RX
SCK  (via drill 0.35)
  Top 0.203: v17.65,14.61 18.91,14.61 19.25,14.27 20.07,14.27 U1.20
  Bottom 0.203: U$3.7 28.32,12.07 26.98,13.41 21.87,13.41 20.93,14.35 17.91,14.35 v17.65,14.61
SPK1
  Bottom 0.305: U$1.SPK1 7.62,49.53 13.34,43.81 19.69,43.81 26.04,37.46 26.04,31.12 17.35,22.43 J5.2
SPK2
  Bottom 0.305: U$1.SPK2 11.43,42.55 19.69,42.55 24.77,37.46 24.77,31.12 20.95,27.3 3.43,27.3 J5.1
SWCLK  (via drill 0.33)
  Top 0.203: v29.84,21.11 29.84,9.05 29.05,8.25 25.56,8.25 22.54,5.24 14.13,5.24 10.48,8.89 10.48,11.91 10.79,12.22 11.59,12.22 U1.45
  Bottom 0.203: v29.84,21.11 30,21.11 30.8,21.91 30.8,26.35 U$22.1
SWDIO  (via drill 0.33)
  Top 0.203: v13.34,12.22 12.86,11.75 11.75,11.75 U1.46 | v22.54,18.73 28.57,24.77 U$19.1
  Bottom 0.203: v13.34,12.22 15.88,12.22 15.88,14.35 20.26,18.73 v22.54,18.73
TX  (via drill 0.33)
  Top 0.203: D5.C 22.54,2.54 24.29,0.79 29.05,0.79 38.26,10 39.53,10 40.48,10.95 40.48,23.5 33.66,30.32 v30.64,30.32
  Bottom 0.203: v30.64,30.32 30.64,34.13 15.24,49.53 U$1.TX
USB_D+  (via drill 0.33)
  Top 0.203: v9.68,16.03 6.83,13.18 4.29,13.18 J13.3 | v14.13,16.35 14.13,17.62 U1.34
  Bottom 0.203: v9.68,16.03 13.81,16.03 v14.13,16.35
USB_D-
  Top 0.203: J13.2 4.29,13.97 5.08,13.97 10.48,19.37 10.48,22.38 11.11,23.02 13.65,23.02 14.61,22.07 14.61,17.78 U1.33
V_USB  (via drill 0.35)
  Top 0.305: J13.1 4.37,14.68 4.65,14.68 8.25,18.28 8.25,23.5 9.77,25.01 C15.2 15.63,22.07 3V_REGULATOR.3 23.37,22.07 23.73,22.44 23.73,23.73 24.77,24.77 24.77,27.3 28.57,31.12 35.43,31.12 J12.1 41.27,36.96 41.27,42.55 37.47,46.35 29.84,46.35 27.29,48.91 C4.1 | U$6.3 13.86,49.27 R11.1 18.4,47.89 v18.41,47.88
  Bottom 0.305: v18.41,47.88 18.92,48.39 26.54,48.39 27.29,49.13 C4.1
VDDCORE
  Top 0.254: C2.1 10.07,12.22 10.07,12.73 10.43,13.08 10.54,13.08 10.7,13.24 11.6,13.24 U1.43

### Text on the board
tPlace: 3.3V | 5V | D10 | SPK | GND | SPK
bPlace: Pickathon 2019 / Trail Experiment | RESET | CLK | Thomas Hudson / 06/30/19 | SWD | D13 | GND | 3.3V